# EAGLE design ESP32 Sensor (EAGLE 9.4.2)
COMPANY: ADAFRUIT INDUSTRIES; DRAWN: KTOWN; REV: B
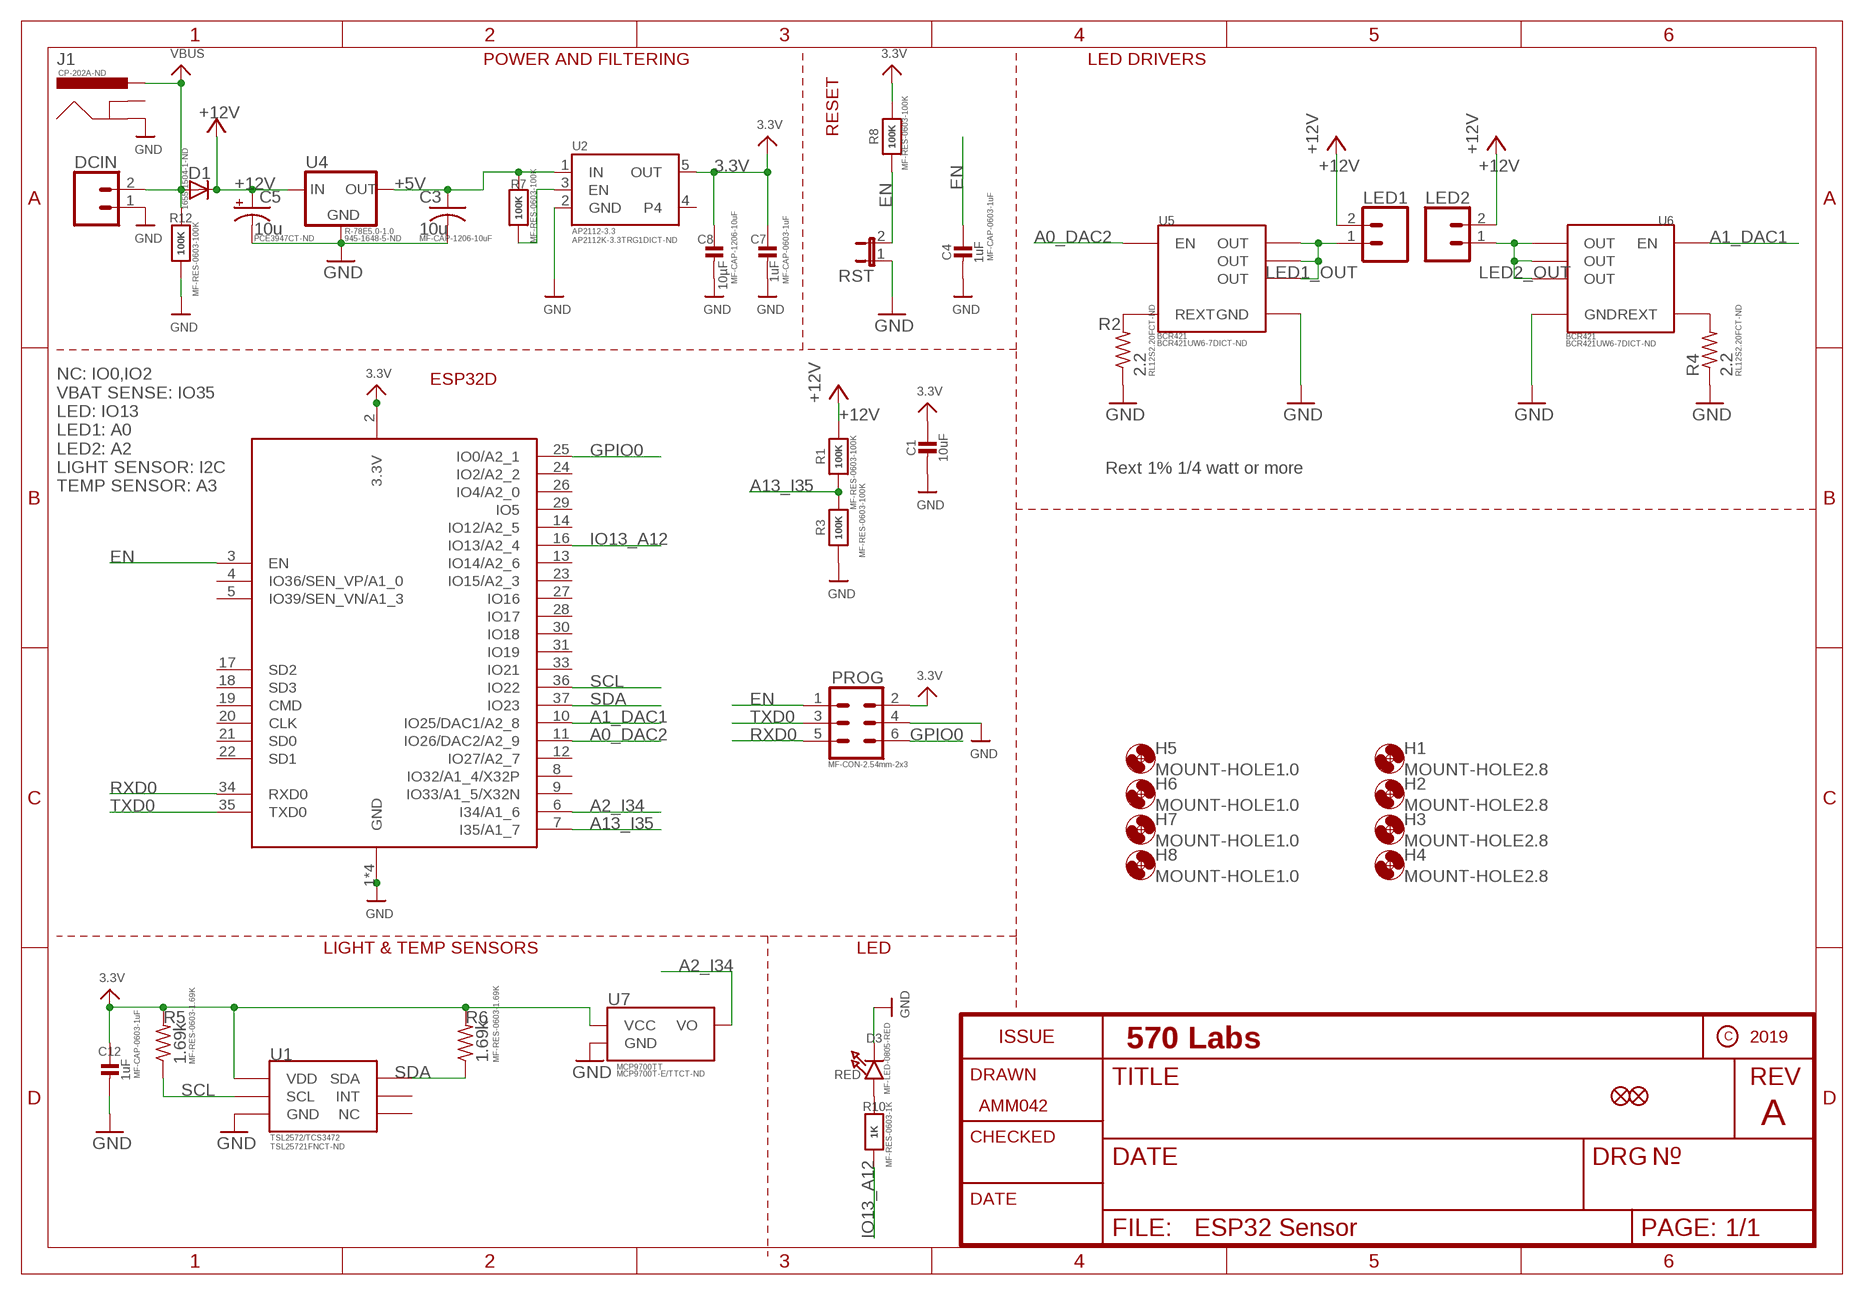
[diagram p0: schematic, sheet 1]
FRAME1 (FRAME_A4): COMPANY: 570 Labs; DRAWN: AMM042; REV: A; YEAR: 2019

## Parts
C1  10uF  CAP_CERAMIC0805-NOOUTLINE  [0805-NO]
C3  10u  C-USC1206  [C1206]
C4  1uF  CAP_CERAMIC0603_NO  [0603-NO]
C5  10u  CPOL-USC  [PANASONIC_C]
C7  1uF  CAP_CERAMIC0603_NO  [0603-NO]
C8  10µF  CAP_CERAMIC_1206  [_1206]
C12  1uF  CAP_CERAMIC0603_NO  [0603-NO]
D1  DIODE-DO214AC  [DO214AC]
D3  RED  LED0805_NOOUTLINE  [CHIPLED_0805_NOOUTLINE]
DCIN  CONN_023.5MM  [SCREWTERMINAL-3.5MM-2]
H1  MOUNT-HOLE2.8  [2,8]
H2  MOUNT-HOLE2.8  [2,8]
H3  MOUNT-HOLE2.8  [2,8]
H4  MOUNT-HOLE2.8  [2,8]
H5  MOUNT-HOLE1.0  [1,0]
H6  MOUNT-HOLE1.0  [1,0]
H7  MOUNT-HOLE1.0  [1,0]
H8  MOUNT-HOLE1.0  [1,0]
J1  POWER_JACKPTH_LOCK  [POWER_JACK_PTH_LOCK]
LED1  CONN_023.5MM  [SCREWTERMINAL-3.5MM-2]
LED2  CONN_023.5MM  [SCREWTERMINAL-3.5MM-2]
PROG  CONN_03X2SHROUD  [2X3-SHROUDED]
R1  100K  RESISTOR_0603_NOOUT  [0603-NO]
R2  2.2  R-US_R0603  [R0603]
R3  100K  RESISTOR_0603_NOOUT  [0603-NO]
R4  2.2  R-US_R0603  [R0603]
R5  1.69k  R-US_R0603  [R0603]
R6  1.69k  R-US_R0603  [R0603]
R7  100K  RESISTOR_0603_NOOUT  [0603-NO]
R8  100K  RESISTOR_0603_NOOUT  [0603-NO]
R10  1K  RESISTOR_0603_NOOUT  [0603-NO]
R12  100K  RESISTOR_0603_NOOUT  [0603-NO]
RST  JP1E  [JP1]
U1  TSL2572/TCS3472  AMS_6FN_SENSOR  [AMS_FN_6]
U2  AP2112-3.3  VREG_SOT23-5  [SOT23-5]
U3  ESP32_WROOM32_SKINNY  [WROOM32_SKINNY]
U4  R-78E5.0-1.0  [DC-DC_CONVERTER_78XX]
U5  BCR421  [SOT26]
U6  BCR421  [SOT26]
U7  MCP9700TT  [SOT23-3]
U$34  FIDUCIAL_1MM  [FIDUCIAL_1MM]
U$35  FIDUCIAL_1MM  [FIDUCIAL_1MM]

## Nets
3.3V [pwr]: C1.1 C7.1 C8.1 C12.1 PROG.2 R5.2 R6.2 R8.2 U1.P$1(VDD) U2.5(OUT) U3.2(3.3V) U7.1(VCC)
+5V [pwr]: C3.1 R7.2 U2.1(IN) U4.VOUT(OUT)
+12V [pwr]: C5.+ D1.C LED1.2 LED2.2 R1.2 U4.VIN(IN)
A0_DAC2: U3.11(IO26/DAC2/A2_9) U5.1(EN)
A1_DAC1: U3.10(IO25/DAC1/A2_8) U6.1(EN)
A2_I34: U3.6(I34/A1_6) U7.2(VO)
A13_I35: R1.1 R3.2 U3.7(I35/A1_7)
EN: C4.1 PROG.1 R8.1 RST.2 U3.3(EN)
GND: C1.2 C3.2 C4.2 C5.- C7.2 C8.2 C12.2 D3.C DCIN.1 J1.GND PROG.4 R2.1 R3.1 R4.1 R12.1 RST.1 U1.P$3(GND) U2.2(GND) U3.1(GND) U3.15(GND) U3.38(GND) U3.P$1(GND) U4.GND U5.4(GND) U6.4(GND) U7.3(GND)
GPIO0: PROG.6 U3.25(IO0/A2_1)
IO13_A12: R10.1 U3.16(IO13/A2_4)
LED1_OUT [pwr]: LED1.1 U5.2(OUT) U5.3(OUT) U5.5(OUT)
LED2_OUT [pwr]: LED2.1 U6.2(OUT) U6.3(OUT) U6.5(OUT)
N$1: R7.1 U2.3(EN)
N$2: R2.2 U5.6(REXT)
N$4: R4.2 U6.6(REXT)
N$5: D3.A R10.2
RXD0: PROG.5 U3.34(RXD0)
SCL: R5.1 U1.P$2(SCL) U3.36(IO22)
SDA: R6.1 U1.P$6(SDA) U3.37(IO23)
TXD0: PROG.3 U3.35(TXD0)
VBUS [pwr]: D1.A DCIN.2 J1.PWR R12.2
Unconnected: J1.GNDBREAK U1.P$4(NC) U1.P$5(INT) U2.4 U3.4(IO36/SEN_VP/A1_0) U3.5(IO39/SEN_VN/A1_3) U3.8(IO32/A1_4/X32P) U3.9(IO33/A1_5/X32N) U3.12(IO27/A2_7) U3.13(IO14/A2_6) U3.14(IO12/A2_5) U3.17(SD2) U3.18(SD3) U3.19(CMD) U3.20(CLK) U3.21(SD0) U3.22(SD1) U3.23(IO15/A2_3) U3.24(IO2/A2_2) U3.26(IO4/A2_0) U3.27(IO16) U3.28(IO17) U3.29(IO5) U3.30(IO18) U3.31(IO19) U3.33(IO21)

## Notes on the sheet
- POWER AND FILTERING | LED DRIVERS
- RESET
- ESP32D
- Rext 1% 1/4 watt or more
- NC: IO0,IO2
  VBAT SENSE: IO35
  LED: IO13
  LED1: A0
  LED2: A2
  LIGHT SENSOR: I2C
  TEMP SENSOR: A3
- LIGHT & TEMP SENSORS | LED

## Library data of the parts
C1 = microbuilder:CAP_CERAMIC: Ceramic Capacitors For new designs, use the packages preceded by an '_' character since they are more reliable: The following footprints should be used on most boards: _0402 - Standard footprint for regular board layouts _0603 - Standard footprint for regular board layouts _0805 - Standard footprint for regular board layouts _1206 - Standard footprint for regular board layouts For extremely tight-pitch boards where space is at a premium, the following 'micro-pitch' footprints can be used (smaller pads, no silkscreen outline, etc.): _0402MP - Micro-pitch footprint for very dense/compact boards _0603MP - Micro-pitch footprint for very dense/compact boards _0805MP - Micro-pitch footprint for very dense/compact boards _1206MP - Micro-pitch footprint for very dense/compact boards
C3 = rcl:C-US: CAPACITOR, American symbol; MF: MF-CAP-1206-10uF
C4 C7 C12 = microbuilder:CAP_CERAMIC: Ceramic Capacitors For new designs, use the packages preceded by an '_' character since they are more reliable: The following footprints should be used on most boards: _0402 - Standard footprint for regular board layouts _0603 - Standard footprint for regular board layouts _0805 - Standard footprint for regular board layouts _1206 - Standard footprint for regular board layouts For extremely tight-pitch boards where space is at a premium, the following 'micro-pitch' footprints can be used (smaller pads, no silkscreen outline, etc.): _0402MP - Micro-pitch footprint for very dense/compact boards _0603MP - Micro-pitch footprint for very dense/compact boards _0805MP - Micro-pitch footprint for very dense/compact boards _1206MP - Micro-pitch footprint for very dense/compact boards; MF: MF-CAP-0603-1uF
C5 = rcl:CPOL-US: POLARIZED CAPACITOR, American symbol; DK: PCE3947CT-ND; SPICEPREFIX: C
C8 = microbuilder:CAP_CERAMIC: Ceramic Capacitors For new designs, use the packages preceded by an '_' character since they are more reliable: The following footprints should be used on most boards: _0402 - Standard footprint for regular board layouts _0603 - Standard footprint for regular board layouts _0805 - Standard footprint for regular board layouts _1206 - Standard footprint for regular board layouts For extremely tight-pitch boards where space is at a premium, the following 'micro-pitch' footprints can be used (smaller pads, no silkscreen outline, etc.): _0402MP - Micro-pitch footprint for very dense/compact boards _0603MP - Micro-pitch footprint for very dense/compact boards _0805MP - Micro-pitch footprint for very dense/compact boards _1206MP - Micro-pitch footprint for very dense/compact boards; MF: MF-CAP-1206-10uF
D1 = diode:DIODE-: DIODE; DK: 1655-1504-1-ND
D3 = microbuilder:LED: LED 0603 - 0603 Surface Mount Package 2mA: Green LED - Low Power (3.9mcd, 2ma, 1.7Vf) - Digikey: 475-2709-2-ND Orange LED - Low Power (9.8mcd, 2ma, 1.8Vf) - Digikey: 475-1194-2-ND Red LED - Low Power (5mcd, 2ma, 1.8Vf) - Digikey: 475-1195-2-ND Yellow LED - Low Power (7mcd, 2ma, 1.8Vf) - Digikey: 475-1196-2-ND 5mA: Blue LED - Low Power (17mcd, 5ma, 2.9Vf) - Digikey: LNJ937W8CRACT-ND 0805 - 0805 Surface Mount Package 2mA: Red LED (8.8mcd, 2mA, 1.8Vf, Clear) - Low Power [Digikey: 475-2510-1-ND] Green LED (5mcd, 2mA, 1.8Vf, Clear) - Low Power [Digikey: 475-2730-1-ND] Yellow LED (11.3mcd, 2mA, 1.8Vf, Clear) - Low Power [Digikey: 475-2555-1-ND] 20mA: Red LED (104mcd, 20mA, Diffused) - LS R976 [Digikey: 475-1278-6-ND] Red LED (12mcd, 20mA, 2.0Vf, Clear) - APT2012EC [Digikey: 754-1128-1-ND] Green LED (15mcd, 20mA, 2.2Vf, Clear) - APT2012GC [Digikey: 754-1131-1-ND] Orange LED (160mcd, 20mA, 2.1Vf, Clear) - APT2012SECK [Digikey: 754-1130-1-ND] 1206 - 1206 Surface Mount Package Green LED (26mcd, 20mA, Diffused) - LG N971 [Digikey: 475-1407-6-ND] Red LED (15mcd, 20mA, Diffused) - LH N974 [Digikey: 475-1416-6-ND] Cree - Cree High-Power Surface Mount LEDs XPEBWT-L1-0000-00D50 - White 111lm 350mA 2.9Vf 6200K 110° XTEAWT-00-0000-00000LEE3 - White 114lm 350mA 2.85Vf 5000K 115° Everlight - Everlight 45-21 Series Surface Mount LEDs 45-21/QK2C-B2832AC2CB2/2T - Warm White 2000mcd 20mA 3.25Vf 3050K 120° 45-21/LK2C-B38452C4CB2/2T - Nuetral White 2000mcd 20mA 3.25Vf 4150K 120° 45-21/LK2C-B50634C6CB2/2T - Cold White 2200mcd 20mA 3.25Vf 5650K 120° PLCC2 Reverse Mount LS T77K-J1L2-1-0-2-R18-Z - Red 11.25mcd 2mA 1.8Vf 630nm 120° LO T77K-L1M2-24-Z - Orange 19.6mcd 2mA 1.8Vf 606nm 120° LY T77K-K2M1-26-Z - Yellow 15.7mcd 2mA 1.8Vf 587nm 120°; MF: MF-LED-0805-RED
DCIN LED1 LED2 = SparkFun-Connectors:CONN_02: Multi connection point. Often used as Generic Header-pin footprint for 0.1 inch spaced/style header connections On any of the 0.1 inch spaced packages, you can populate with these: Break Away Headers - Straight <https://www.sparkfun.com/products/116> (PRT-00116) Break Away Male Headers - Right Angle <https://www.sparkfun.com/products/553> (PRT-00553) Female Headers <https://www.sparkfun.com/products/115> (PRT-00115) Break Away Headers - Machine Pin <https://www.sparkfun.com/products/117> (PRT-00117) Break Away Female Headers - Swiss Machine Pin <https://www.sparkfun.com/products/743> (PRT-00743) For SCREWTERMINALS and SPRING TERMINALS visit here: Screw Terimnals on SparkFun.com <https://www.sparkfun.com/search/results?term=Screw+Terminals> (5mm/3.5mm/2.54mm spacing) This device is also useful as a general connection point to wire up your design to another part of your project. Our various solder wires solder well into these plated through hole pads. Hook-Up Wire - Assortment (Stranded, 22 AWG) <https://www.sparkfun.com/products/11375> (PRT-11375) Hook-Up Wire - Assortment (Solid Core, 22 AWG) <https://www.sparkfun.com/products/11367> (PRT-11367) View the entire wire category on our website here <https://www.sparkfun.com/categories/141> Special notes: Molex polarized connector foot print use with: PRT-08233 with associated crimp pins and housings. 2.54_SCREWTERM for use with PRT-10571. 3.5mm Screw Terminal footprints for PRT-08084 5mm Screw Terminal footprints for use with PRT-08432; PROD_ID: CONN-08399
H1-H4 = holes:MOUNT-HOLE: MOUNTING HOLE with drill center marker
H5-H8 = 570labs:MOUNT-HOLE: MOUNTING HOLE with drill center marker
J1 = SparkFun-Connectors:POWER_JACK: Power Jack Connector This is the standard 5.5mm barrel jack for power. The PTH is the most common, proven, reliable, footprint. The Slot footprint only works if the mill layer is transmitted to the PCB fab house so be warned. Here are the connectors we sell at SparkFun: DC Barrel Power Jack/Connector <https://www.sparkfun.com/products/119> (PRT-00119) DC Barrel Power Jack/Connector (SMD) <https://www.sparkfun.com/products/12748> (PRT-12748) DC Barrel Jack Adapter - Breadboard Compatible <https://www.sparkfun.com/products/10811> (PRT-10811) It is used on this SparkFun product (and many, many others): SparkFun RedBoard - Programmed with Arduino <https://www.sparkfun.com/products/12757> (DEV-12757) Also, if you need a mating power supply or connector, please check these out: Wall Adapter Power Supply - 9VDC 650mA <https://www.sparkfun.com/products/298> (TOL-00298) DC Barrel Jack Adapter - Male <https://www.sparkfun.com/products/10287> (PRT-10287); PROD_ID: CONN-08197; SF_ID: PRT-00119
PROG = SparkFun-Connectors:CONN_03X2: Multi connection point. Often used as Generic Header-pin footprint for 0.1 inch spaced/style header connections You can populate with any combo of single row headers, but if you'd like an exact match, check these: Header - 2x3 (Male, 0.1") <https://www.sparkfun.com/products/12807> (PRT-12807) Header - 2x3 (Female, 0.1") <https://www.sparkfun.com/products/13010> (PRT-13010) 2x3 Pin Shrouded Header <https://www.sparkfun.com/products/10877> (PRT-10877) On any of the 0.1 inch spaced packages, you can populate with these: Break Away Headers - Straight <https://www.sparkfun.com/products/116> (PRT-00116) Break Away Male Headers - Right Angle <https://www.sparkfun.com/products/553> (PRT-00553) Female Headers <https://www.sparkfun.com/products/115> (PRT-00115) Break Away Headers - Machine Pin <https://www.sparkfun.com/products/117> (PRT-00117) Break Away Female Headers - Swiss Machine Pin <https://www.sparkfun.com/products/743> (PRT-00743) Special note: the shrouded connector mates well with our 3x2 ribbon cables: Ribbon Crimp Connector - 6-pin (2x3, Female) <https://www.sparkfun.com/products/10651> (PRT-10651) Ribbon Cable - 6 wire (15ft) <https://www.sparkfun.com/products/10646> (PRT-10646); MF: MF-CON-2.54mm-2x3; PROD_ID: CONN-10681; SF_ID: PRT_10877
R1 R3 R7 R8 R12 = microbuilder:RESISTOR: Resistors For new designs, use the packages preceded by an '_' character since they are more reliable: The following footprints should be used on most boards: _0402 - Standard footprint for regular board layouts _0603 - Standard footprint for regular board layouts _0805 - Standard footprint for regular board layouts _1206 - Standard footprint for regular board layouts For extremely tight-pitch boards where space is at a premium, the following 'micro-pitch' footprints can be used (smaller pads, no silkscreen outline, etc.): _0402MP - Micro-pitch footprint for very dense/compact boards _0603MP - Micro-pitch footprint for very dense/compact boards _0805MP - Micro-pitch footprint for very dense/compact boards _1206MP - Micro-pitch footprint for very dense/compact boards; MF: MF-RES-0603-100K
R2 R4 = resistor:R-US_: RESISTOR, American symbol; DK: RL12S2.20FCT-ND
R5 R6 = resistor:R-US_: RESISTOR, American symbol; MF: MF-RES-0603-1.69K
R10 = microbuilder:RESISTOR: Resistors For new designs, use the packages preceded by an '_' character since they are more reliable: The following footprints should be used on most boards: _0402 - Standard footprint for regular board layouts _0603 - Standard footprint for regular board layouts _0805 - Standard footprint for regular board layouts _1206 - Standard footprint for regular board layouts For extremely tight-pitch boards where space is at a premium, the following 'micro-pitch' footprints can be used (smaller pads, no silkscreen outline, etc.): _0402MP - Micro-pitch footprint for very dense/compact boards _0603MP - Micro-pitch footprint for very dense/compact boards _0805MP - Micro-pitch footprint for very dense/compact boards _1206MP - Micro-pitch footprint for very dense/compact boards; MF: MF-RES-0603-1K
RST = jumper:JP1E: JUMPER
U1 = 570labs:AMS_6FN_SENSOR; DK: TSL25721FNCT-ND
U2 = microbuilder:VREG_SOT23-5: SOT23-5 Fixed Voltage Regulators Part Current Out V Out V In V Dropout θJA (°C/W) TJ (°C) Digikey Part No. ADP121 150mA 3.3V 3.4-5.5V 0.09V @ 150mA -- -- ADP121-AUJZ33R7CT-ND ADP121 150mA 3.0V 3.1-5.5V 0.09V @ 150mA -- -- ADP121-AUJZ30R7CT-ND ADP122 300mA 3.3V 3.4-5.5V 0.085V @ 300mA -- -- ADP122AUJZ-3.3-R7CT-ND ADP1712 300mA 3.3V 3.5-5.5V 0.17V @ 300mA -- -- ADP1712AUJZ-3.3-R7TR-ND AP7311 (Low Cost) 150mA 3.3V 3.5-6V 0.15V @ 150mA -- -- AP7311-33WG-7DICT-ND LD39015M18R 150mA 1.8V 1.9V-5.5V 0.08V @ 100mA -- -- 497-6977-1-ND LP2985A-33DBVR 150mA 3.3V 3.3-16V 0.28V @ 150mA 206 150 296-18479-1-ND MCP1824T-3302E/OT 300mA 3.3V 3.5V-6V 0.2V @ 300mA -- -- MCP1824T-3302E/OTCT-ND MIC5205-2.5YM5 TR 150mA 2.5V 2.7-16V 0.165V @ 150mA -- -- 576-1257-2-ND MIC5205-3.0YM5 TR 150mA 3.0V 3.2V-16V 0.165V @ 150mA -- -- 576-1258-2-ND MIC5205-3.3YM5 TR 150mA 3.3V 3.5V-16V 0.165V @ 150mA -- -- 576-1259-2-ND TPS780330220 150mA 3.3V+2.2V 3.6-5.5V 250mV Max -- -- 296-23332-1-ND TDA3663/N1,135 100mA 3.3V 3.5-45V 0.18V @ 50mA -- -- 568-5343-1-ND Max operating temp can be calculated using θJA, TJ (max junction temperature), and power in watts. Set the "Maximum Ambient Temperature" until it reaches TJ ("Max Junction Temperature"), which is the absolute limit for safe use of the regulator: Heat Sink Temperature Calculator <http://www.daycounter.com/Calculators/Heat-Sink-Temperature-Calculator.phtml> For example, With 12V source into a 3.3V LP2985 and a 30mA load, we are dissipating (12V-3.3V) * 0.03A = 0.261W. With a θJA of 206 °C/W, a TJ of 150°C, and 261mW we can safely use the chip without a heat sink up to 75°C (=147.1°C Junction Temperature).; DK: AP2112K-3.3TRG1DICT-ND
U3 = microbuilder:ESP32_WROOM32
U4 = SparkFun-IC-Power:R-78E5.0-1.0: Recom Power 5V 1A DC/DC Converter The Recom R-78E5.0-X.X is a compact DC/DC converter module that is a pin for pin drop-in replacement for the LM7805 linear voltage regulator. Specifications: Input Range: 7-28V Output Voltage: 5V Output Current: 1A Max Efficiency: 91% Datasheet <https://www.recom-power.com/pdf/Innoline/R-78Exx-1.0.pdf>; DK: 945-1648-5-ND; PROD_ID: COM-13655
U5 U6 = 570labs:BCR421; DK: BCR421UW6-7DICT-ND
U7 = SparkFun-Sensors:MCP9700: Microchip MCP9700 Analog-Output Temperature Sensor The MCP9700 can accurately measure temperature from -40C to +150C. The output of the MCP9700 is calibrated to a slope of 10mV/°C and has a DC offset of 500mV. The offset allows reading negative temperatures without the need for a negative supply. Datasheet <http://ww1.microchip.com/downloads/en/DeviceDoc/20001942F.pdf> SparkFun Products LilyPad Temperature Sensor <https://www.sparkfun.com/products/8777> (DEV-08777) SparkFun Digital Sandbox <https://www.sparkfun.com/products/12651> (DEV-12651); DK: MCP9700T-E/TTCT-ND; PROD_ID: IC-08917
U$34 U$35 = microbuilder:FIDUCIAL: Fiducial Alignment Points Various fiducial points for machine vision alignment.; BOM: EXCLUDE

## Net classes
1 pwr: width 0.406 mm, drill 0.305 mm, clearance 0.203 mm

## Board
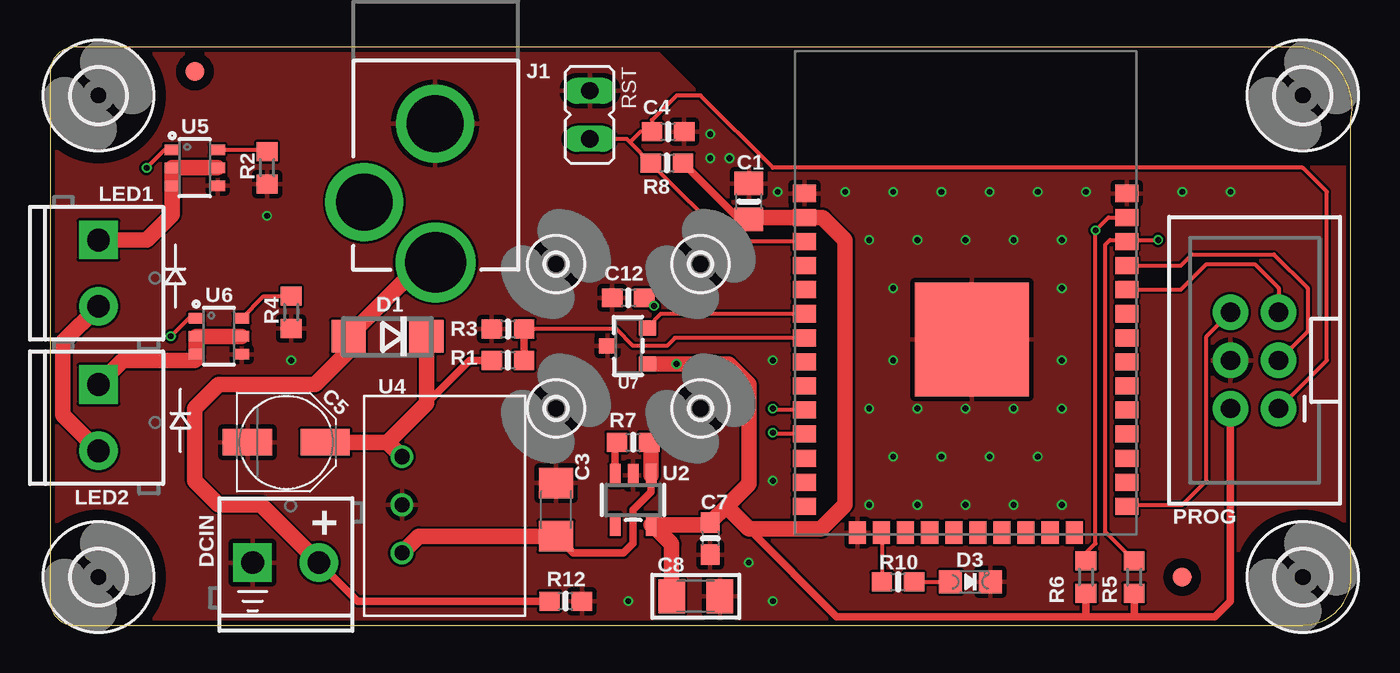
[diagram p1: board, top side]
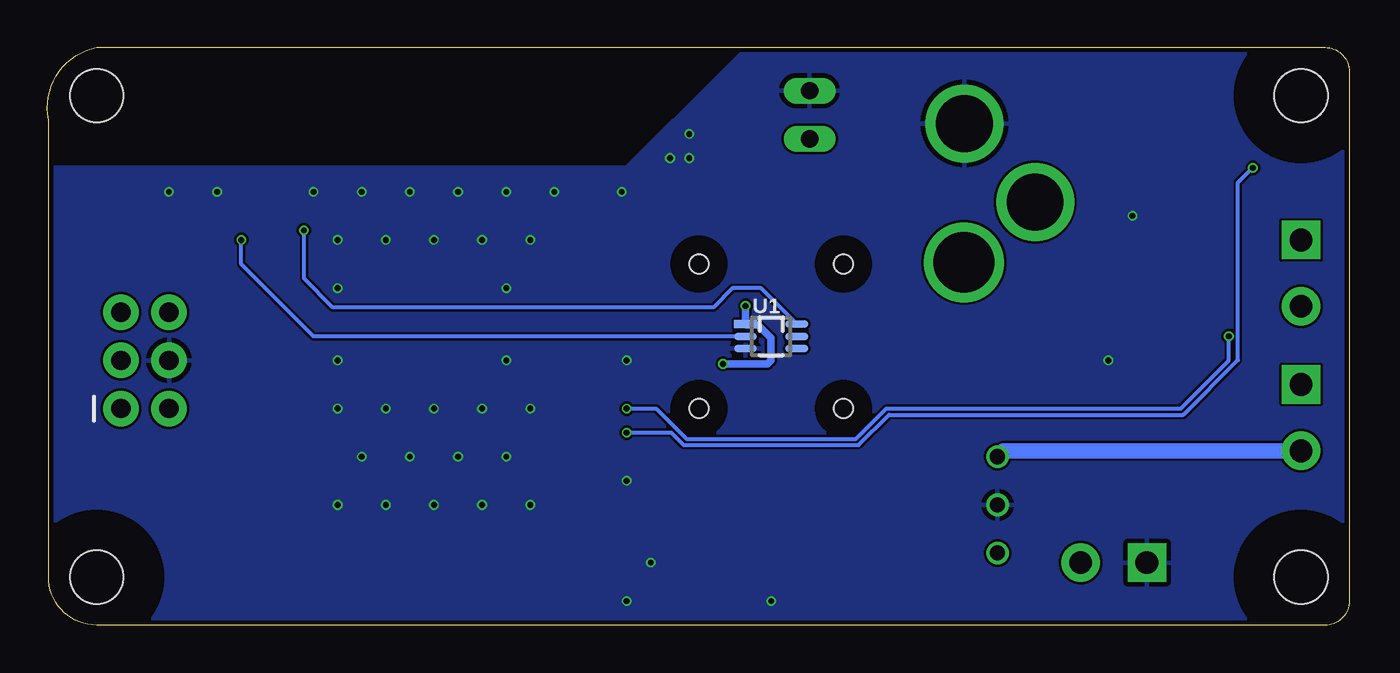
[diagram p2: board, bottom side, seen from below]

Size 68.64 x 30.48 mm. Coordinates in mm from the lower left corner, seen from the top.
Outline: 1.27,0 66.04,0 arc90 68.58,2.54 68.58,26.67 arc90 66.04,30.48 1.27,30.48 arc90 0,29.21 0,1.27 arc90 1.27,0
Copper layers (1*16): Top 0.035mm / dielectric 1.5mm / Bottom 0.035mm
Design rules "MF_Standard_2_Layer": minimum track width 5mil, minimum drill 10mil, track to track 5mil, track to pad 5mil, pad to pad 5mil, via to via 5mil, smd to smd 0mil, copper to edge 10mil, drill to drill 10mil, minimum pad ring 4mil, minimum via ring 4mil, stop-mask expansion 2mil, vias tented up to drill 25mil, thermal gap 10mil

### Footprints (pad centres in the part's own frame; a part is rotated, then mirrored left to right if it is on the bottom)
0805-NO = smd 1.24 x 1.5: 1 -0.95,0; 2 0.95,0
C1206 = smd 1.6 x 1.8: 1 -1.4,0; 2 1.4,0
0603-NO = smd 1.075 x 1: 1 -0.85,0; 2 0.85,0
PANASONIC_C = smd 2.6 x 1.4: + 2.05,0; - -2.05,0
_1206 = smd 1.4 x 1.8: 1 -1.27,0; 2 1.27,0
DO214AC = smd 1.8 x 1.7: A 2.05,0; C -2.05,0
CHIPLED_0805_NOOUTLINE = smd 1.2 x 1.2: A 0,-1.05; C 0,1.05
SCREWTERMINAL-3.5MM-2 = drill 1.2 pad 2.032 square: 1 0,0 | drill 1.2 pad 2.032: 2 3.5,0
2,8 = hole 2.8: 0,0
1,0 = hole 1: 0,0
POWER_JACK_PTH_LOCK = drill 2.997 pad 4.115: GND 0.025,6.557; GNDBREAK 3.762,10.7 | drill 3.2 pad 4.115: PWR 0,13.878
2X3-SHROUDED = drill 1.016 pad 1.88: 1 -1.27,2.54; 2 1.27,2.54; 3 -1.27,0; 4 1.27,0; 5 -1.27,-2.54; 6 1.27,-2.54
R0603 = smd 1 x 1.1: 1 -0.85,0; 2 0.85,0
JP1 = drill 0.914 long: 1 0,-1.27; 2 0,1.27
AMS_FN_6 = smd 1.2 x 0.4: P$1 -1.35,0.65; P$2 -1.35,0; P$3 -1.35,-0.65; P$4 1.35,-0.65; P$5 1.35,0; P$6 1.35,0.65
SOT23-5 = smd 0.55 x 1.2: 1 -0.95,-1.3; 2 0,-1.3; 3 0.95,-1.3; 4 0.95,1.3; 5 -0.95,1.3
WROOM32_SKINNY = smd 1.2 x 0.9: 1 -8.5,5; 2 -8.5,3.73; 3 -8.5,2.46; 4 -8.5,1.19; 5 -8.5,-0.08; 6 -8.5,-1.35; 7 -8.5,-2.62; 8 -8.5,-3.89; 9 -8.5,-5.16; 10 -8.5,-6.43; 11 -8.5,-7.7; 12 -8.5,-8.97; 13 -8.5,-10.24; 14 -8.5,-11.51; 25 8.5,-11.51; 26 8.5,-10.24; 27 8.5,-8.97; 28 8.5,-7.7; 29 8.5,-6.43; 30 8.5,-5.16; 31 8.5,-3.89; 32 8.5,-2.62; 33 8.5,-1.35; 34 8.5,-0.08; 35 8.5,1.19; 36 8.5,2.46; 37 8.5,3.73; 38 8.5,5 | smd 0.9 x 1.2: 15 -5.7,-12.9; 16 -4.43,-12.9; 17 -3.16,-12.9; 18 -1.89,-12.9; 19 -0.62,-12.9; 20 0.65,-12.9; 21 1.92,-12.9; 22 3.19,-12.9; 23 4.46,-12.9; 24 5.73,-12.9 | smd 6 x 6: P$1 0.34,-2.7
DC-DC_CONVERTER_78XX = drill 0.8: GND 0,0; VIN -2.54,0; VOUT 2.54,0
SOT26 = smd 0.55 x 0.8: 1 -0.95,-1.2; 2 0,-1.2; 3 0.95,-1.2; 4 0.95,1.2; 5 0,1.2; 6 -0.95,1.2
SOT23-3 = smd 0.8 x 0.9: 1 -0.95,-1; 2 0.95,-1; 3 0,1.1
FIDUCIAL_1MM = smd 1 x 1: 1 0,0

### Placement (x,y rotation side)
C1  36.83,22.35 90 top
C3  26.67,6.1 90 top
C4  32.58,26.04 0 top
C5  12.45,9.65 0 top
C7  34.8,4.57 270 top
C8  34.04,1.52 0 top
C12  30.48,17.27 180 top
D1  17.78,15.24 180 top
D3  48.51,2.29 270 top
DCIN  10.67,3.3 0 top
H1  2.54,2.54 0 top
H2  2.54,27.94 0 top
H3  66.04,27.94 0 top
H4  66.04,2.54 0 top
H5  26.67,19.05 0 top
H6  34.29,19.05 0 top
H7  26.67,11.43 0 top
H8  34.29,11.43 0 top
J1  20.32,33.02 180 top
LED1  2.54,20.32 270 top
LED2  2.54,12.7 270 top
PROG  63.5,13.97 180 top
R1  24.13,13.97 180 top
R2  11.43,24.13 90 top
R3  24.13,15.62 0 top
R4  12.7,16.51 90 top
R5  57.15,2.54 270 top
R6  54.61,2.54 270 top
R7  30.73,9.65 0 top
R8  32.51,24.38 0 top
R10  44.7,2.29 0 top
R12  27.18,1.27 180 top
RST  28.45,26.92 180 top
U1  30.48,15.24 0 bottom
U2  30.73,6.6 180 top
U3  48.26,17.78 0 top
U4  18.54,6.35 270 top
U5  7.62,24.13 270 top
U6  8.89,15.24 270 top
U7  30.48,14.73 90 top
U$34  59.69,2.54 270 top
U$35  7.62,29.21 270 top

### Tracks (layer width: path | path; a pad name or v marks a point on that pad's centre or on a via)
3.3V  (via drill 0.3)
  Top 0.406: U2.5 31.75,5.24 | v31.83,16.84 31.4,17.27 C12.1 | R8.2 36.24,21.51 36.94,21.51 | PROG.2 62.23,1.27 61.42,0.46 57.15,0.46 | 36.83,5.08 41.45,0.46 54.61,0.46 | 57.15,0.46 54.61,0.46 | R6.2 54.61,0.46 | R5.2 57.15,0.46
  Top 0.813: C12.1 31.43,17.17 | C1.1 36.94,21.51 U3.2 40.72,21.51 41.91,20.32 41.91,6.35 40.64,5.08 36.83,5.08 35.64,6.27 | U2.5 31.75,5.3 | 31.75,5.3 34.68,5.3 C7.1 35.64,6.27 | C8.1 32.77,4.29 31.75,5.3 | 35.64,6.27 36.83,7.45 36.83,12.7 35.75,13.78 v33.02,13.78 U7.1
  Bottom 0.406: v31.83,16.84 U1.P$1 31.79,15.85 31.18,15.85 30.48,15.15 30.48,13.97 30.67,13.78 v33.02,13.78
+5V
  Top 0.406: U2.1 31.68,7.05 30.73,6.1 30.73,4.32 30.23,3.81 27.56,3.81 C3.1
  Top 0.813: R7.2 31.68,9.55 U2.1 | U4.VOUT 19.43,4.7 C3.1
+12V
  Top 0.406: R1.2 22.1,13.97 19.83,11.7
  Top 0.813: LED1.2 0.66,14.94 0.66,11.08 LED2.2 | U4.VIN 17.78,9.65 | 17.78,9.65 C5.+ | D1.C 19.83,11.7 17.78,9.65
  Bottom 0.813: LED2.2 18.23,9.2 U4.VIN
A0_DAC2  (via drill 0.3)
  Top 0.203: U3.11 38.18,10.08 v38.1,10.16 | v5.08,24.13 6.03,25.08 U5.1
  Bottom 0.203: v38.1,10.16 35.75,10.16 35.09,9.5 25.87,9.5 24.27,11.1 8.75,11.1 5.87,13.99 5.87,23.34 v5.08,24.13
A1_DAC1  (via drill 0.3)
  Top 0.203: U3.10 38.18,11.35 v38.1,11.43 | v6.35,15.24 7.3,16.19 U6.1
  Bottom 0.203: v38.1,11.43 36.55,11.43 34.95,9.83 26.01,9.83 24.4,11.43 8.89,11.43 6.35,13.97 v6.35,15.24
A2_I34
  Top 0.203: U7.2 31.48,15.7 32.21,16.43 U3.6
A13_I35
  Top 0.203: U3.7 32.94,15.16 32.51,14.73 30.73,14.73 29.85,15.62 R3.2
  Top 0.406: R1.1 R3.2
EN
  Top 0.203: U3.3 35.81,20.24 R8.1 30.56,25.48 | RST.2 30.39,25.65 30.56,25.48 | 30.56,25.48 31.11,26.04 C4.1 31.73,26.64 33.02,27.94 34.29,27.94 38.1,24.13 66.04,24.13 67.31,22.86 67.31,13.97 PROG.1
GND  (via drill 0.3)
  other vias: 41.91,22.86 44.45,22.86 46.99,22.86 49.53,22.86 52.07,22.86 54.61,22.86 53.34,20.32 50.8,20.32 48.26,20.32 45.72,20.32 43.18,20.32 44.45,17.78 53.34,17.78 44.45,13.97 45.72,11.43 44.45,8.89 46.99,8.89 49.53,8.89 52.07,8.89 53.34,11.43 53.34,13.97 53.34,6.35 50.8,6.35 48.26,6.35 45.72,6.35 43.18,6.35 50.8,11.43 48.26,11.43 43.18,11.43 59.69,22.86 62.23,22.86 34.8,25.91 34.8,24.64 35.81,24.64 38.35,22.86 38.1,13.97 38.1,7.62 36.83,3.3 38.1,1.27 30.48,1.27 11.43,21.59 12.7,13.97
  pour Top: -1.27,-1.27 74.93,-1.27 74.93,24.13 38.1,24.13 29.21,33.02 -1.27,33.02
  pour Bottom: -2.54,34.29 27.94,34.29 38.1,24.13 69.85,24.13 69.85,-1.27 -2.54,-1.27
GPIO0
  Top 0.203: U3.25 56.84,6.35 59.69,6.35 60.96,7.62 60.96,15.24 PROG.6
IO13_A12
  Top 0.203: U3.16 43.85,4.86 R10.1
LED1_OUT
  Top 0.813: U5.2 6.42,21.66 5.08,20.32 LED1.1 | U5.5 U5.2 | U5.3 U5.2
LED2_OUT
  Top 0.813: LED2.1 3.81,13.97 7.62,13.97 7.69,14.04 U6.3 U6.2 U6.5
N$1
  Top 0.406: R7.1 29.78,9.55 U2.3
N$2
  Top 0.203: U5.6 11.33,25.08 R2.2
N$4
  Top 0.203: U6.6 11.26,17.36 R4.2
N$5
  Top 0.203: R10.2 D3.A
RXD0
  Top 0.203: U3.34 59.61,17.7 60.96,19.05 63.5,19.05 64.77,17.78 PROG.5
SCL  (via drill 0.3)
  Top 0.203: R5.1 55.63,4.91 55.63,20.07 55.88,20.32 56.68,20.32 U3.36 56.84,20.32 v58.42,20.32
  Bottom 0.203: U1.P$2 54.61,15.24 58.42,19.05 v58.42,20.32
SDA  (via drill 0.3)
  Top 0.203: R6.1 54.61,3.81 55.12,4.32 v55.12,20.83 55.8,21.51 U3.37
  Bottom 0.203: U1.P$6 31.02,17.78 32.51,17.78 33.53,16.76 53.59,16.76 55.12,18.29 v55.12,20.83
TXD0
  Top 0.203: U3.35 59.61,18.97 60.2,19.56 64.52,19.56 66.29,17.78 66.29,15.49 PROG.3
VBUS
  Top 0.406: DCIN.2 16.2,1.27 R12.2
  Top 0.813: DCIN.2 11.12,6.35 8.89,6.35 7.62,7.62 7.62,11.43 8.89,12.7 13.97,12.7 15.73,14.46 D1.A 19.63,19.14 J1.PWR

### Text on the board
tNames: +
Measures: 570 LABS LLC | 2019 | A